# Altium schematic sheet Connector.SchDoc
size A; SheetNumber: 8; SheetTotal: 9
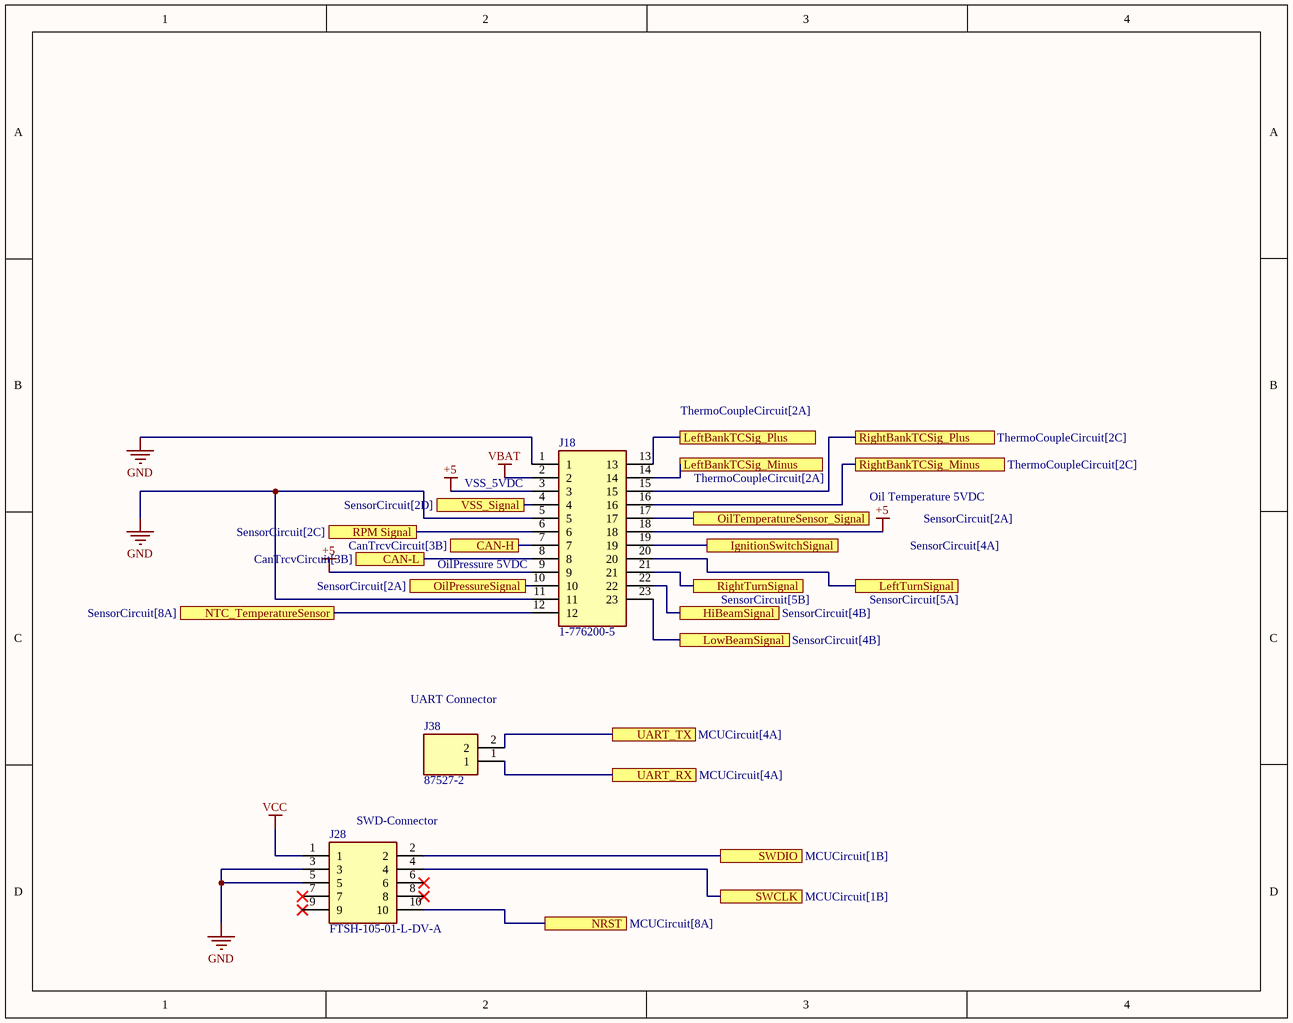
[diagram p0: Connector.SchDoc]

## Parts
J18  1-776200-5  [17762005]
J28  FTSH-105-01-L-DV-A  [FTSH-105-XX-YYY-DV-A]
J38  87527-2  [HDRV2W66P0X254_1X2_467X244X1044P]

## Ports
CAN-H (see CanTrcvCircuit[3B]), CAN-L (see CanTrcvCircuit[3B]), HiBeamSignal (see SensorCircuit[4B]), IgnitionSwitchSignal (see SensorCircuit[4A]), LeftBankTCSig_Minus (see ThermoCoupleCircuit[2A]), LeftBankTCSig_Plus (see ThermoCoupleCircuit[2A]), LeftTurnSignal (see SensorCircuit[5A]), LowBeamSignal (see SensorCircuit[4B]), NRST (see MCUCircuit[8A]), NTC_TemperatureSensor (see SensorCircuit[8A]), OilPressureSignal (see SensorCircuit[2A]), OilTemperatureSensor_Signal (see SensorCircuit[2A]), RightBankTCSig_Minus (see ThermoCoupleCircuit[2C]), RightBankTCSig_Plus (see ThermoCoupleCircuit[2C]), RightTurnSignal (see SensorCircuit[5B]), RPM Signal (see SensorCircuit[2C]), SWCLK (see MCUCircuit[1B]), SWDIO (see MCUCircuit[1B]), UART_RX (see MCUCircuit[4A]), UART_TX (see MCUCircuit[4A]), VSS_Signal (see SensorCircuit[2D])

## Nets
+5: J18.3 J18.9 J18.18
GND: J18.1 J18.5 J18.11 J28.3 J28.5
VBAT: J18.2
VCC: J28.1
CAN-H: J18.7 ; port CAN-H
CAN-L: J18.8 ; port CAN-L
HiBeamSignal: J18.22 ; port HiBeamSignal
IgnitionSwitchSignal: J18.19 ; port IgnitionSwitchSignal
LeftBankTCSig_Minus: J18.14 ; port LeftBankTCSig_Minus
LeftBankTCSig_Plus: J18.13 ; port LeftBankTCSig_Plus
LeftTurnSignal: J18.20 ; port LeftTurnSignal
LowBeamSignal: J18.23 ; port LowBeamSignal
NRST: J28.10 ; port NRST
NTC_TemperatureSensor: J18.12 ; port NTC_TemperatureSensor
OilPressureSignal: J18.10 ; port OilPressureSignal
OilTemperatureSensor_Signal: J18.17 ; port OilTemperatureSensor_Signal
RightBankTCSig_Minus: J18.16 ; port RightBankTCSig_Minus
RightBankTCSig_Plus: J18.15 ; port RightBankTCSig_Plus
RightTurnSignal: J18.21 ; port RightTurnSignal
RPM Signal: J18.6 ; port RPM Signal
SWCLK: J28.4 ; port SWCLK
SWDIO: J28.2 ; port SWDIO
UART_RX: J38.1 ; port UART_RX
UART_TX: J38.2 ; port UART_TX
VSS_Signal: J18.4 ; port VSS_Signal

Not connected (* = marked no-connect by the designer): J28 6* 7* 8* 9*

## Notes on the sheet
- (near J18) VSS_5VDC
- Oil Temperature 5VDC
- (near J18) OilPressure 5VDC
- (near J38) UART Connector
- (near J28) SWD-Connector

## Library data of the parts
J18 = 1-776200-5: Connector; Manufacturer_Name: TE Connectivity; Datasheet Link: https://www.te.com/commerce/DocumentDelivery/DDEController?Action=showdoc&DocId=Customer+Drawing%7F776200%7FE%7Fpdf%7FEnglish%7FENG_CD_776200_E.pdf%7F1-776200-5; Height: 34.25mm; Manufacturer_Part_Number: 1-776200-5; Mouser Part Number: 571-1-776200-5; Mouser Price/Stock: https://www.mouser.co.uk/ProductDetail/TE-Connectivity-AMP/1-776200-5?qs=YqNA2qefETBJbWsdhRcFeA%3D%3D
J28 = FTSH-105-01-L-DV-A: Connector; Manufacturer_Name: SAMTEC; Datasheet Link: http://suddendocs.samtec.com/prints/ftsh-1xx-xx-xxx-dv-xxx-xxx-mkt.pdf; Manufacturer_Part_Number: FTSH-105-01-L-DV-A; Mouser Part Number: 200-FTSH10501LDVA; Mouser Price/Stock: https://www.mouser.co.uk/ProductDetail/Samtec/FTSH-105-01-L-DV-A?qs=vqM95g%252BRBeykLJELFbssPw%3D%3D; Arrow Part Number: FTSH-105-01-L-DV-A; Arrow Price/Stock: https://www.arrow.com/en/products/ftsh-105-01-l-dv-a/samtec
J38 = 87527-2: Connector; Manufacturer_Name: TE Connectivity; Datasheet Link: https://www.te.com/commerce/DocumentDelivery/DDEController?Action=showdoc&DocId=Customer+Drawing%7F87527%7FH%7Fpdf%7FEnglish%7FENG_CD_87527_H.pdf%7F87527-2; Height: 10.439mm; Manufacturer_Part_Number: 87527-2; Mouser Part Number: 571-875272; Mouser Price/Stock: https://www.mouser.co.uk/ProductDetail/TE-Connectivity/87527-2?qs=ZDXmSm13593hsB4j%252B6gMfg%3D%3D; Arrow Part Number: 87527-2; Arrow Price/Stock: https://www.arrow.com/en/products/87527-2/te-connectivity?region=nac